# EAGLE design sun_bear (EAGLE 6.5.0)
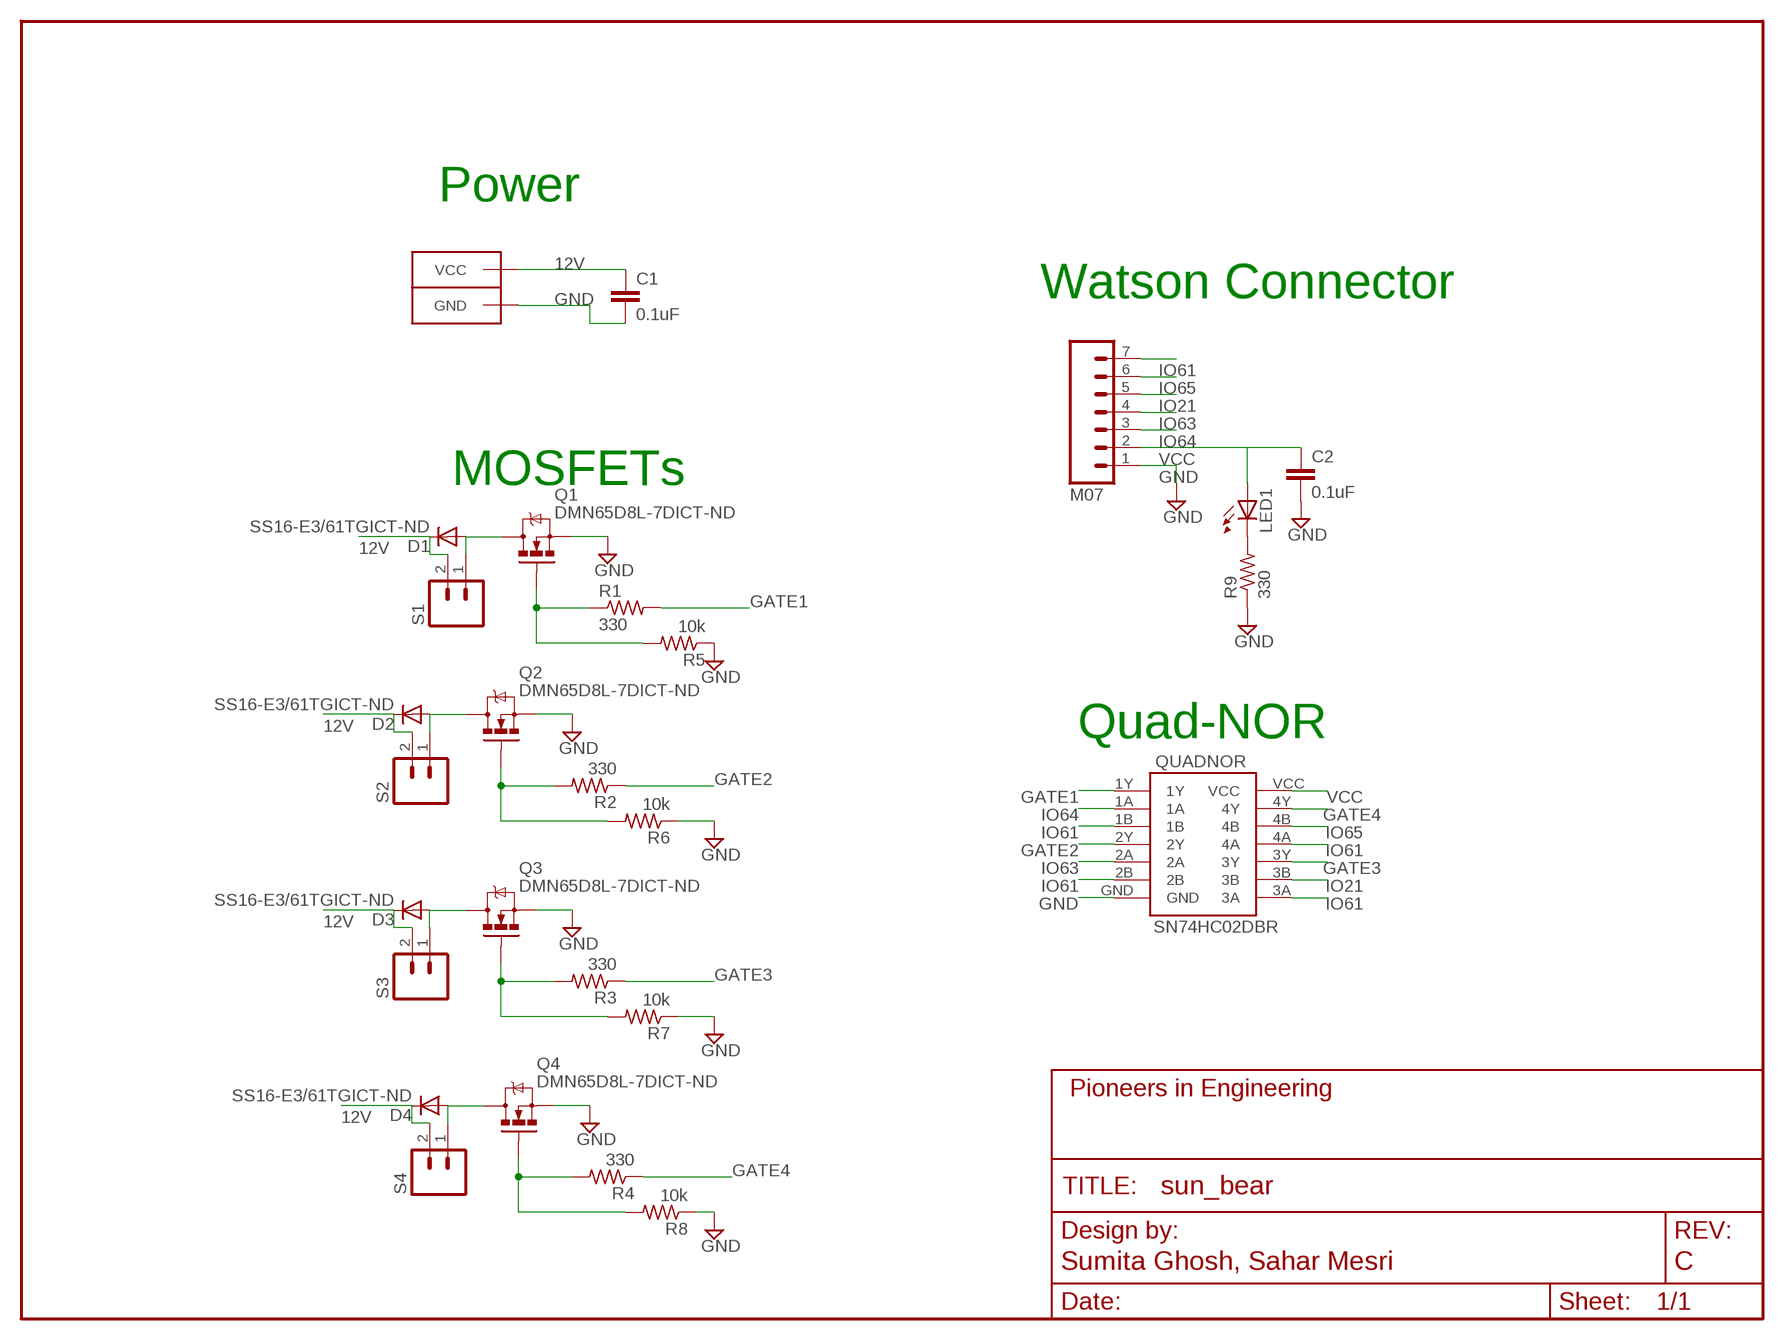
[diagram p0: schematic, sheet 1]
FRAME1 (FRAME-LETTER): AUTHOR: Sumita Ghosh, Sahar Mesri; REVISION: C

## Parts
C1  0.1uF  CAP0603-CAP  [0603-CAP]
C2  0.1uF  CAP0603-CAP  [0603-CAP]
D1  SS16-E3/61TGICT-ND  DIODESMA-ALT  [SMA-DIODE_ALT]
D2  SS16-E3/61TGICT-ND  DIODESMA-ALT  [SMA-DIODE_ALT]
D3  SS16-E3/61TGICT-ND  DIODESMA-ALT  [SMA-DIODE_ALT]
D4  SS16-E3/61TGICT-ND  DIODESMA-ALT  [SMA-DIODE_ALT]
LED1  LED0805  [LED-0805]
POWER  ANDERSONVERTICAL  [ANDERSON_VERTICAL]
Q1  DMN65D8L-7DICT-ND  MOSFET-NCHANNELSMD  [SOT23-3]
Q2  DMN65D8L-7DICT-ND  MOSFET-NCHANNELSMD  [SOT23-3]
Q3  DMN65D8L-7DICT-ND  MOSFET-NCHANNELSMD  [SOT23-3]
Q4  DMN65D8L-7DICT-ND  MOSFET-NCHANNELSMD  [SOT23-3]
QUADNOR  SN74HC02DBR  [QUADNOR]
R1  330  R-US_R0603  [R0603]
R2  330  R-US_R0603  [R0603]
R3  330  R-US_R0603  [R0603]
R4  330  R-US_R0603  [R0603]
R5  10k  R-US_R0603  [R0603]
R6  10k  R-US_R0603  [R0603]
R7  10k  R-US_R0603  [R0603]
R8  10k  R-US_R0603  [R0603]
R9  330  R-US_R0603  [R0603]
S1  M021X02-MTA  [1X02-MTA]
S2  M021X02-MTA  [1X02-MTA]
S3  M021X02-MTA  [1X02-MTA]
S4  M021X02-MTA  [1X02-MTA]
WATSON  M07  [1X07-MTA]

## Nets
12V [power]: C1.1 D1.C D2.C D3.C D4.C POWER.PIN2(VCC) S1.2 S2.2 S3.2 S4.2
GATE1: QUADNOR.1Y R1.2
GATE2: QUADNOR.2Y R2.1
GATE3: QUADNOR.3Y R3.1
GATE4: QUADNOR.4Y R4.1
GND: C1.2 C2.2 POWER.PIN1(GND) Q1.2(S) Q2.2(S) Q3.2(S) Q4.2(S) QUADNOR.GND R5.1 R6.1 R7.1 R8.1 R9.1 WATSON.1
IO21: QUADNOR.3B WATSON.5
IO61: QUADNOR.1B QUADNOR.2B QUADNOR.3A QUADNOR.4A WATSON.7
IO63: QUADNOR.2A WATSON.4
IO64: QUADNOR.1A WATSON.3
IO65: QUADNOR.4B WATSON.6
N$1: LED1.C R9.2
N$2: D1.A Q1.3(D) S1.1
N$3 [power]: D4.A Q4.3(D) S4.1
N$4 [power]: D3.A Q3.3(D) S3.1
N$8 [power]: D2.A Q2.3(D) S2.1
N$15: Q1.1(G) R1.1 R5.2
N$16: Q2.1(G) R2.2 R6.2
N$17: Q3.1(G) R3.2 R7.2
N$18: Q4.1(G) R4.2 R8.2
VCC [power]: C2.1 LED1.A QUADNOR.VCC WATSON.2

## Notes on the sheet
- Power
- Watson Connector
- MOSFETs
- Quad-NOR

## Library data of the parts
C1 C2 = pie:CAP: Capacitor Standard 0603 ceramic capacitor, and 0.1" leaded capacitor.
D1-D4 = pie:DIODE: Diode These are standard reverse protection diodes and small signal diodes. SMA package can handle up to about 1A. SOD-323 can handle about 200mA. What the SOD-323 package when ordering, there are some mfgs out there that are 5-pin packages.; PARTNUMBER: SS16-E3/61TGICT-ND
LED1 = pie:LED: LEDs Standard schematic elements and footprints for 5mm, 3mm, 1206, and 0603 sized LEDs. 5mm - Spark Fun Electronics SKU : COM-00529 (and others)
POWER = pie:ANDERSON: 2-pin 25A Anderson Connector http://www.alliedelec.com/images/products/datasheets/bm/ANDERSON_POWER_PRODUCTS/70162018.pdf; PARTNUMBER: 1377G3
Q1-Q4 = pie:MOSFET-NCHANNEL: N-Type MOSFET, SOT23-3 Package; PARTNUM: DMN65D8L-7DICT-ND
QUADNOR = pie:SN74HC02DBR: Quad-NOR IC, SSOP14 Package, Part Number SN74HC02DBR; PARTNUMBER: 296-8204-1-ND
R1-R9 = pie:R-US_: RESISTOR, American symbol
S1-S4 = pie:M02: 2-pin 0.1-inch header and MTA connector; PARTNUMBER: A1921-ND
WATSON = pie:M07: 7-pin 0.1-inch header and MTA connector; PARTNUMBER: A19472-ND

## Net classes
1 power: width 0.406 mm, drill 0.381 mm, clearance 0.203 mm

## Board
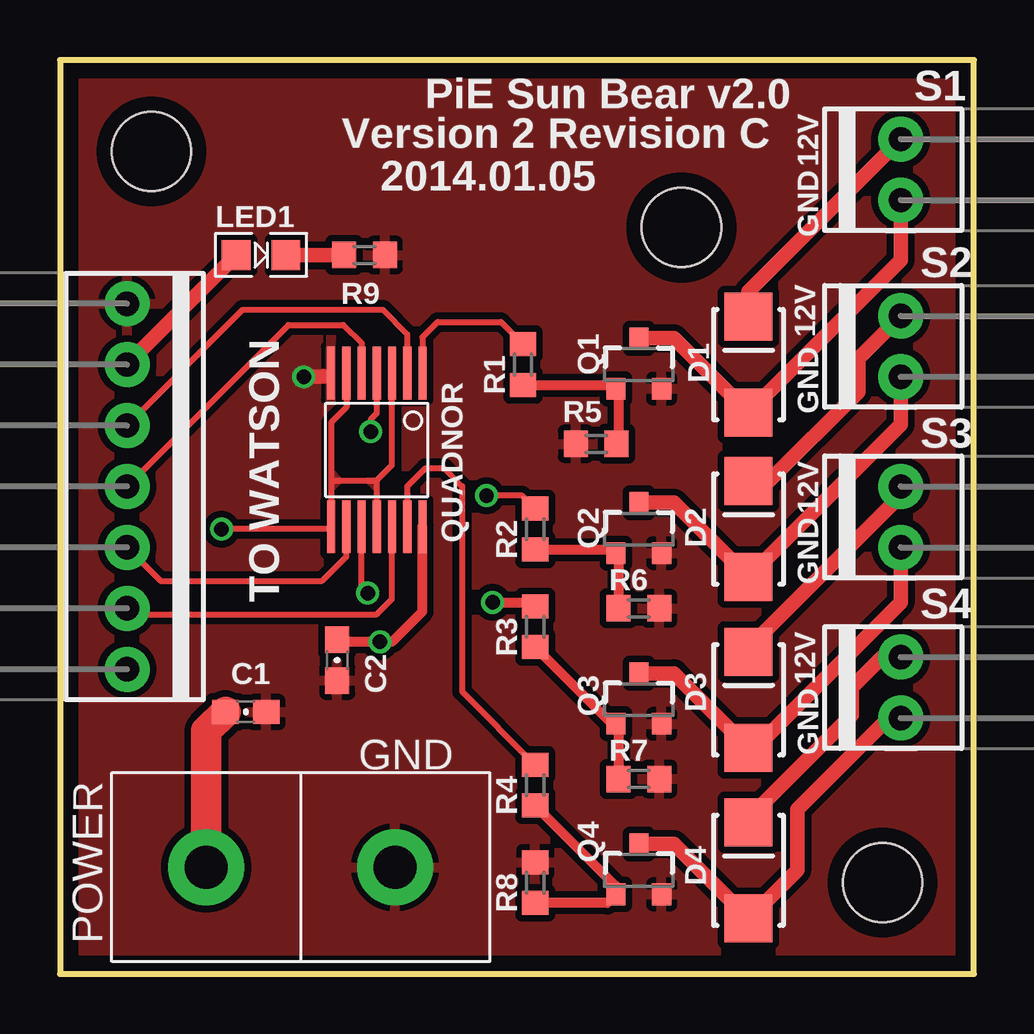
[diagram p1: board, top side]
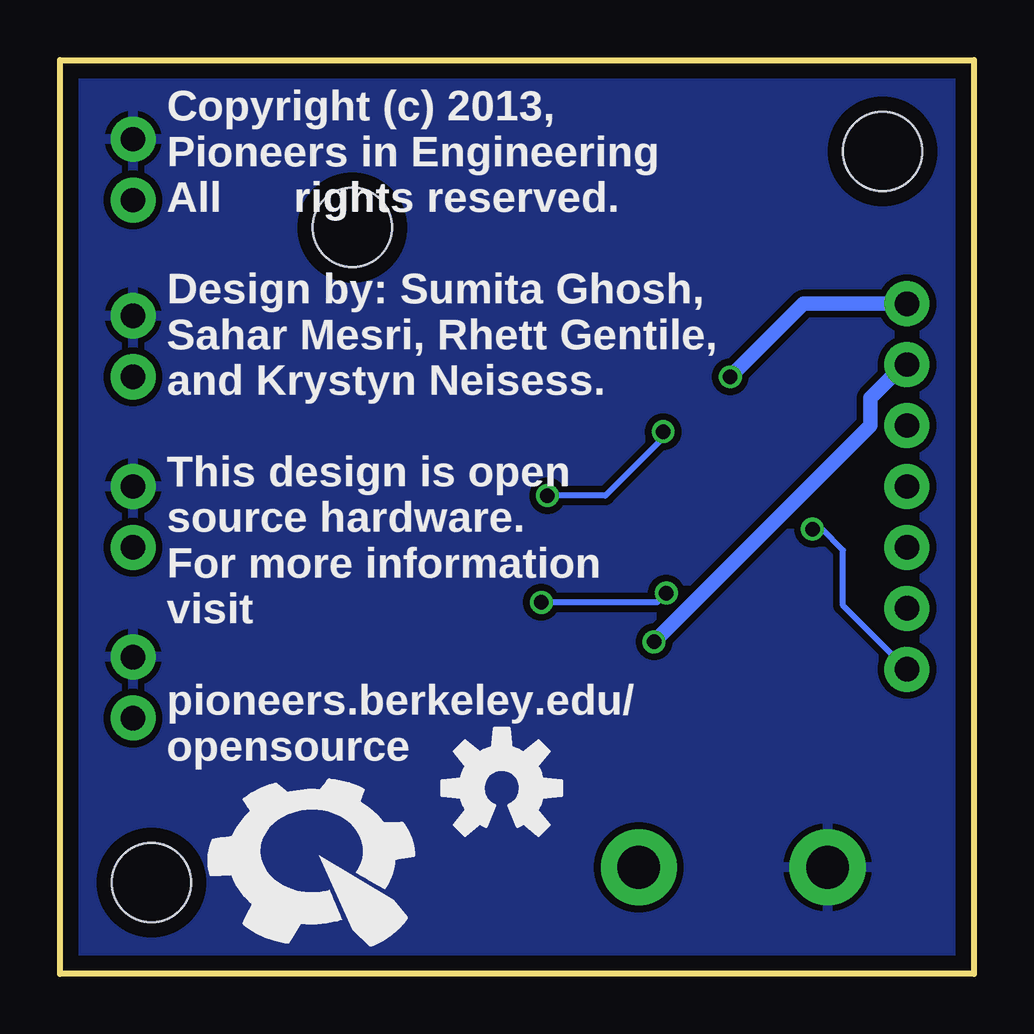
[diagram p2: board, bottom side, seen from below]

Size 38.1 x 38.1 mm. Coordinates in mm from the lower left corner, seen from the top.
Outline: 0,0 38.1,0 38.1,38.1 0,38.1 0,0
Copper layers (1*16): Top 2mil / dielectric 9mil / Bottom 2mil
Design rules "advancedcircuits-33each-pie": minimum track width 6mil, minimum drill 15mil, track to track 6mil, track to pad 10mil, pad to pad 6mil, via to via 6mil, smd to smd 6mil, copper to edge 25mil, drill to drill 7mil, minimum pad ring 7mil, minimum via ring 7mil, stop-mask expansion 3mil, vias tented up to drill 0mil, thermal gap 10mil

### Footprints (pad centres in the part's own frame; a part is rotated, then mirrored left to right if it is on the bottom)
0603-CAP = smd 1.1 x 1: 1 -0.85,0; 2 0.85,0
SMA-DIODE_ALT = smd 2 x 2: A -2,0; C 2,0
LED-0805 = smd 1.194 x 1.245: A -1.041,0; C 1.041,0
ANDERSON_VERTICAL = drill 1.778 pad 3.175: PIN1 0,-3.937; PIN2 0,3.937
SOT23-3 = smd 0.8 x 0.9: 1 -0.95,-1; 2 0.95,-1; 3 0,1.1
QUADNOR = smd 0.35 x 2.2: 1A -1.27,-3.2; 1B -0.635,-3.2; 1Y -1.905,-3.2; 2A 0.635,-3.2; 2B 1.27,-3.2; 2Y 0,-3.2; 3A 1.905,3.2; 3B 1.27,3.2; 3Y 0.635,3.2; 4A 0,3.2; 4B -0.635,3.2; 4Y -1.27,3.2; GND 1.905,-3.2; VCC -1.905,3.2
R0603 = smd 1 x 1.1: 1 -0.85,0; 2 0.85,0
1X02-MTA = drill 1.016 pad 1.88: 1 -1.27,0; 2 1.27,0
STAND-OFF = hole 3.302: 0,0
1X07-MTA = drill 1.016 pad 1.88: 1 -7.62,0; 2 -5.08,0; 3 -2.54,0; 4 0,0; 5 2.54,0; 6 5.08,0; 7 7.62,0

### Placement (x,y rotation side)
C1  7.75,10.92 0 top
C2  11.56,13.08 270 top
D1  28.7,25.4 90 top
D2  28.7,18.54 90 top
D3  28.7,11.43 90 top
D4  28.7,4.32 90 top
LED1  8.38,29.97 0 top
POWER  10.03,4.45 90 top
Q1  24.13,25.4 0 top
Q2  24.13,18.54 0 top
Q3  24.13,11.43 0 top
Q4  24.13,4.32 0 top
QUADNOR  13.21,21.84 180 top
R1  19.3,25.4 90 top
R2  19.81,18.54 270 top
R3  19.81,14.48 270 top
R4  19.81,7.87 270 top
R5  22.35,22.1 0 top
R6  24.13,15.24 180 top
R7  24.13,8.13 180 top
R8  19.81,3.81 270 top
R9  12.7,29.97 180 top
S1  35.05,33.53 90 top
S2  35.05,26.16 90 top
S3  35.05,19.05 90 top
S4  35.05,11.94 90 top
U$1  [PIE-LOGO-SMALL]  27.3,4.95 0 bottom
U$3  Mounting + Test  [STAND-OFF]  3.81,34.29 0 top
U$4  Mounting + Test  [STAND-OFF]  34.29,3.81 0 top
U$5  [OSHW-LOGO-M]  19.68,7.75 0 bottom
U$6  Mounting + Test  [STAND-OFF]  25.91,31.11 0 top
WATSON  2.79,20.32 270 top

### Tracks (layer width: path | path; a pad name or v marks a point on that pad's centre or on a via)
12V
  Top 0.406: D3.C 28.7,13.97
  Top 0.61: D1.C 28.7,28.45 S1.2 | D2.C 29.56,20.54 33.27,24.26 33.27,25.65 S2.2 | D3.C 28.7,13.59 34.8,19.68 34.8,20.07 S3.2 | D4.C 28.7,6.48 33.02,10.79 33.02,11.94 34.29,13.21 S4.2
  Top 1.27: C1.1 6.1,10.12 POWER.PIN2
  pour Bottom (isolate 0.279): 0,38.1 38.1,38.1 38.1,0 0,0
GATE1
  Top 0.254: R1.2 18.38,27.18 15.75,27.18 15.11,26.54 QUADNOR.1Y
GATE2  (via drill 0.6)
  Top 0.254: QUADNOR.2Y 13.21,23.37 12.95,23.11 v12.95,22.61 | R2.1 19.27,19.94 v17.78,19.94
  Bottom 0.254: v12.95,22.61 12.95,22.35 15.37,19.94 v17.78,19.94
GATE3  (via drill 0.6)
  Top 0.254: v12.83,15.88 12.57,16.13 QUADNOR.3Y
  Top 0.406: v18.03,15.49 19.65,15.49 R3.1
  Bottom 0.254: v18.03,15.49 13.21,15.49 v12.83,15.88
GATE4
  Top 0.254: 14.54,18.61 14.48,18.54 QUADNOR.4Y 14.48,20.32 15.24,21.08 16,21.08 16.76,20.32 16.76,11.77 R4.1
GND  (via drill 0.6)
  Top 0.254: QUADNOR.GND 11.15,24.89
  Top 0.61: 11.15,24.89 v10.16,24.89
  Bottom 0.61: WATSON.1 7.11,27.94 v10.16,24.89
  pour Top (isolate 0.279): 0,38.1 0,0 38.1,0 38.1,38.1
IO21
  Top 0.254: WATSON.5 4.19,16.38 10.92,16.38 11.94,17.4 QUADNOR.3B
IO61  (via drill 0.6)
  Top 0.254: 13.21,20.57 QUADNOR.4A | v6.73,18.54 11.2,18.54 QUADNOR.3A 11.3,20.57 | 11.3,20.57 11.3,22.99 11.94,23.62 QUADNOR.2B | QUADNOR.1B 13.84,21.21 13.21,20.57 | 11.3,20.57 13.21,20.57
  Bottom 0.254: WATSON.7 5.46,15.37 5.46,17.65 6.35,18.54 v6.73,18.54
  pour Top: 13.21,20.57 12.83,20.57 13.21,20.19
  pour Top: 11.3,20.19 11.68,20.57 11.3,20.95
IO63
  Top 0.254: WATSON.4 9.53,27.05 11.81,27.05 12.57,26.29 QUADNOR.2A
IO64
  Top 0.254: QUADNOR.1A 14.48,26.67 13.46,27.69 7.62,27.69 WATSON.3
IO65
  Top 0.254: WATSON.6 3.05,14.99 13.21,14.99 13.84,15.62 QUADNOR.4B
N$1
  Top 0.61: LED1.C R9.2
N$2
  Top 0.61: Q1.3 25.6,26.5 D1.A 35.05,29.75 S1.1
N$3
  Top 0.61: S4.1 34.54,10.67 30.73,6.86 30.73,4.32 28.73,2.32 D4.A 25.6,5.42 Q4.3
N$4
  Top 0.61: S3.1 35.05,15.49 28.99,9.43 D3.A 25.6,12.53 Q3.3
N$8
  Top 0.61: Q2.3 25.6,19.64 D2.A 35.05,22.89 S2.1
N$15
  Top 0.406: R1.1 23.03,24.55 Q1.1 23.28,24.4 23.28,22.18 R5.2
N$16
  Top 0.406: R2.2 23.03,17.69 Q2.1 23.28,17.54 R6.2
N$17
  Top 0.406: R3.2 23.01,10.43 Q3.1 23.28,10.43 R7.2
N$18
  Top 0.406: R4.2 23.18,3.66 Q4.1 22.82,2.96 R8.2
VCC  (via drill 0.6)
  Top 0.406: QUADNOR.VCC 15.11,15.11 13.84,13.84 v13.34,13.84 11.64,13.84 C2.1
  Top 0.61: WATSON.2 2.79,25.43 LED1.A
  Bottom 0.61: v13.34,13.84 9.02,18.16 8.26,18.92 4.32,22.86 4.32,24 2.92,25.4 WATSON.2

### Text on the board
tPlace: Version 2 Revision C | 2014.01.05 | 12V | GND | 12V | GND | 12V | GND | TO WATSON | 12V | GND | GND
bPlace: Copyright (c) 2013, / Pioneers in Engineering / All rights reserved. / / Design by: Sumita Ghosh, / Sahar Mesri, Rhett Gentile, / and Krystyn Neisess. / / This design is open / source hardware. / For more information / visit / / pioneers.berkeley.edu/ / opensource
tNames: PiE Sun Bear v2.0